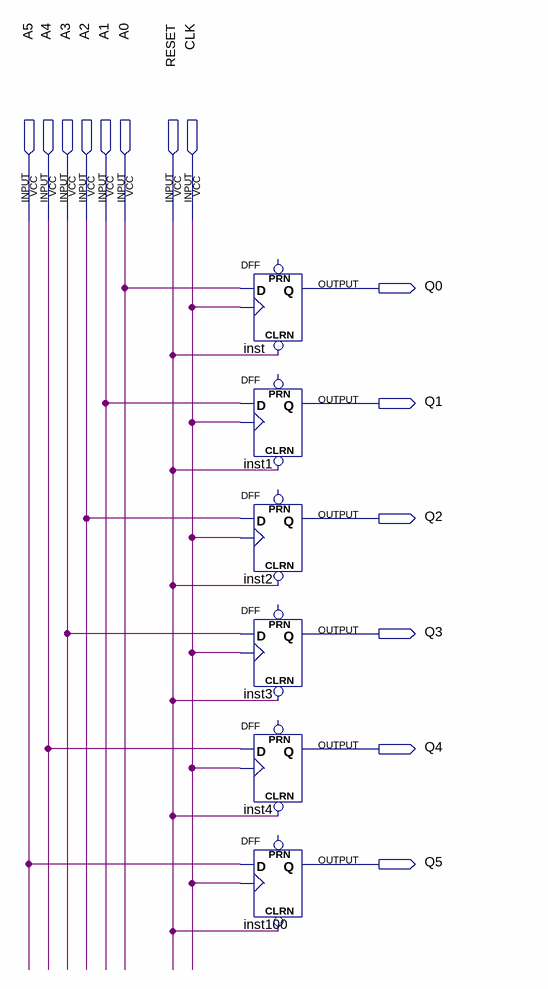
[diagram p0: schematic sheet]
// Quartus schematic pipo6reset0.bdf as structural Verilog: 6 symbols, 14 pins
module pipo6reset0 (
  input  A5,
  input  A4,
  input  A3,
  input  A2,
  input  A1,
  input  A0,
  input  RESET,
  input  CLK,
  output Q0,
  output Q1,
  output Q2,
  output Q3,
  output Q4,
  output Q5
);

  DFF inst (.CLRN(RESET), .CLK(CLK), .D(A0), .Q(Q0));  // open: PRN
  DFF inst1 (.CLRN(RESET), .CLK(CLK), .D(A1), .Q(Q1));  // open: PRN
  DFF inst2 (.CLRN(RESET), .CLK(CLK), .D(A2), .Q(Q2));  // open: PRN
  DFF inst3 (.CLRN(RESET), .CLK(CLK), .D(A3), .Q(Q3));  // open: PRN
  DFF inst4 (.CLRN(RESET), .CLK(CLK), .D(A4), .Q(Q4));  // open: PRN
  DFF inst100 (.CLRN(RESET), .CLK(CLK), .D(A5), .Q(Q5));  // open: PRN
endmodule
